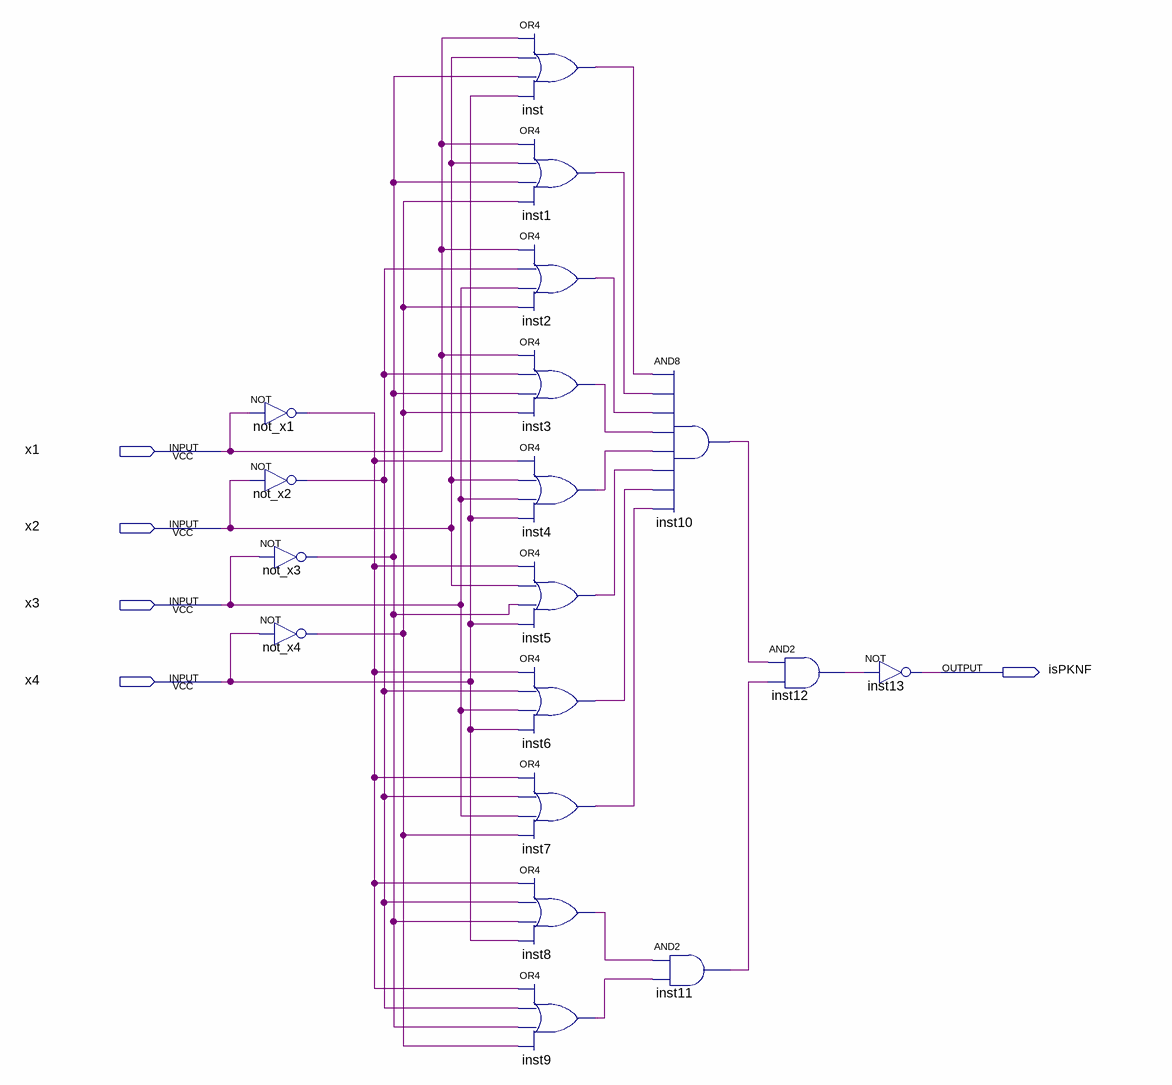
[diagram p0: schematic sheet]
// Quartus schematic PKNF_scheme.bdf as structural Verilog: 18 symbols, 5 pins
module PKNF_scheme (
  input  x1,
  input  x2,
  input  x3,
  input  x4,
  output isPKNF
);

  wire inst1_out, inst2_out, inst3_out, inst4_out, inst5_out, inst6_out, inst7_out, inst8_out, inst9_out,
       inst10_out, inst11_out, inst12_out, inst_out, not_x1_out, not_x2_out, not_x3_out, not_x4_out;

  not not_x1 (not_x1_out, x1);
  not not_x2 (not_x2_out, x2);
  not not_x3 (not_x3_out, x3);
  not not_x4 (not_x4_out, x4);
  or inst (inst_out, x1, x2, not_x3_out, x4);
  or inst1 (inst1_out, x1, x2, not_x3_out, not_x4_out);
  or inst2 (inst2_out, x1, not_x2_out, x3, not_x4_out);
  or inst3 (inst3_out, x1, not_x2_out, not_x3_out, not_x4_out);
  or inst4 (inst4_out, not_x1_out, x2, x3, x4);
  or inst5 (inst5_out, not_x1_out, x2, not_x3_out, x4);
  or inst6 (inst6_out, not_x1_out, not_x2_out, x3, x4);
  or inst7 (inst7_out, not_x1_out, not_x2_out, x3, not_x4_out);
  or inst8 (inst8_out, not_x1_out, not_x2_out, not_x3_out, x4);
  or inst9 (inst9_out, not_x1_out, not_x2_out, not_x3_out, not_x4_out);
  and inst10 (inst10_out, inst_out, inst1_out, inst2_out, inst3_out, inst4_out, inst5_out, inst6_out, inst7_out);
  and inst11 (inst11_out, inst8_out, inst9_out);
  and inst12 (inst12_out, inst10_out, inst11_out);
  not inst13 (isPKNF, inst12_out);
endmodule
